# Altium schematic sheet OBC_SRAM.SchDoc: SRAM
size A4; SheetNumber: 8; SheetTotal: 10
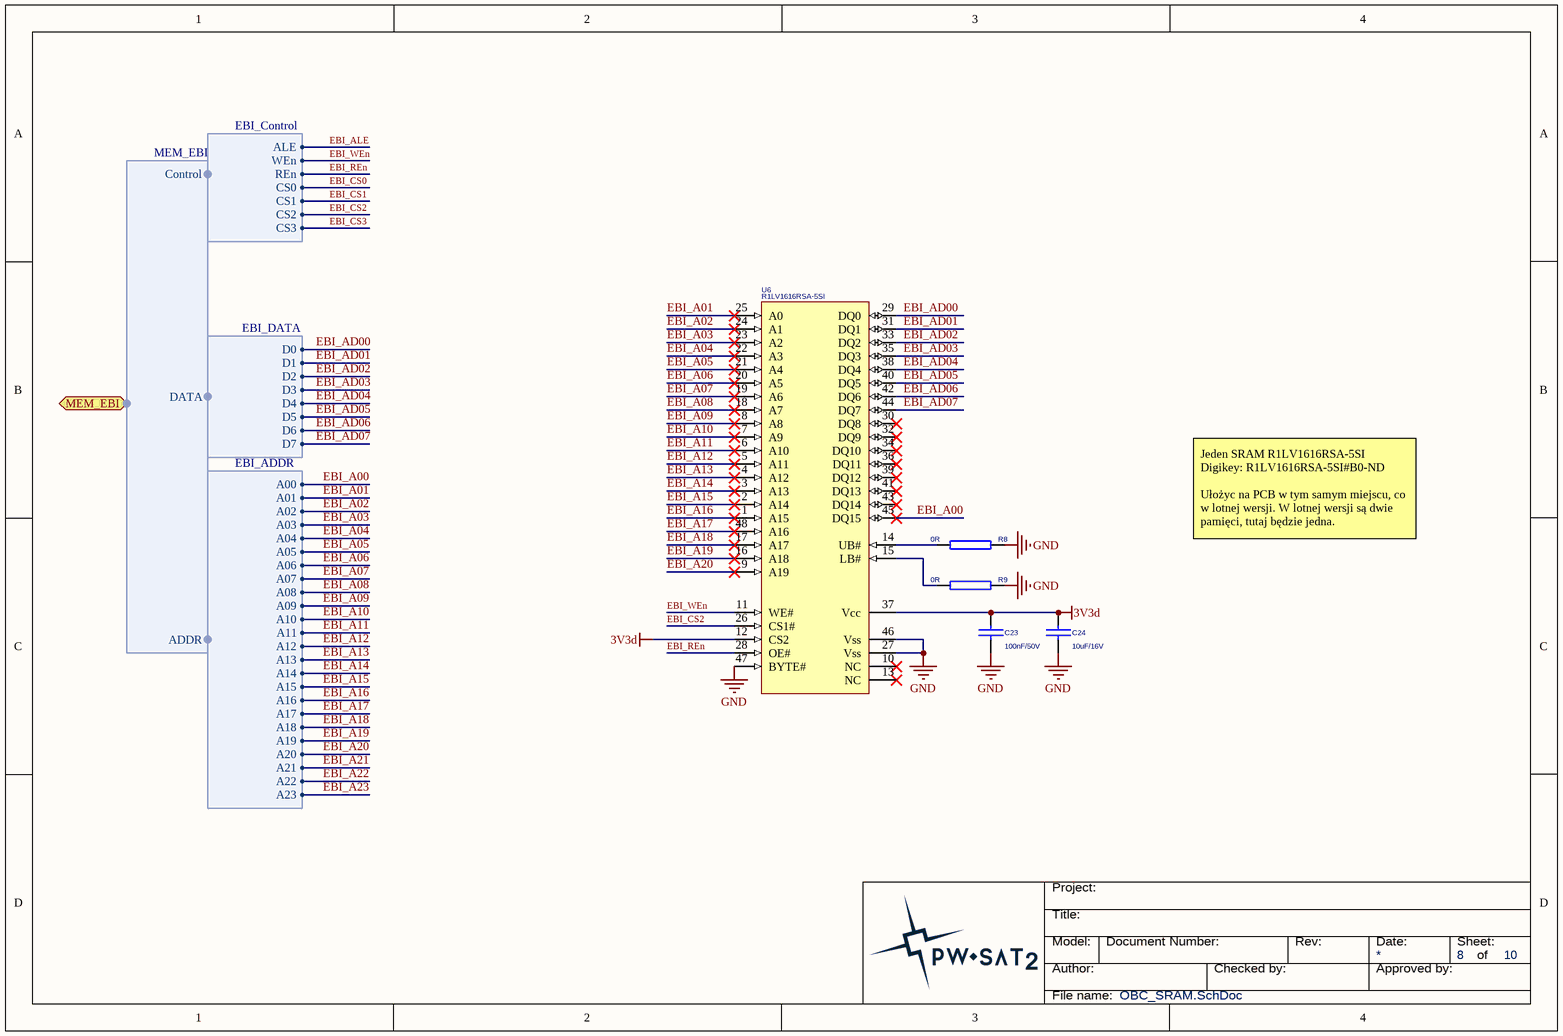
[diagram p0: OBC_SRAM.SchDoc]

## Parts
C23  100nF/50V  [C0603]
C24  10uF/16V  [C1206]
R8  0R  [R0603]
R9  0R  [R0603]
U6  R1LV1616RSA-5SI  [TSSOP50P2000X125-48N]

## Ports
MEM_EBI (harness MEM_EBI)

## Harnesses
MEM_EBI: DATA, ADDR, Control
EBI_Control: ALE, WEn, REn, CS0, CS1, CS2, CS3
EBI_ADDR: A09, A10, A11, A12, A13, A14, A15, A08, A16, A17, A18, A19, A20, A21, A22, A23, A00, A01, A02, A03, A04, A05, A06, A07
EBI_DATA: D6, D5, D4, D3, D2, D1, D0, D7

## Nets
3V3d: C23.1 C24.1 U6.12(CS2) U6.37(Vcc)
GND: C23.2 C24.2 R8.2 R9.2 U6.27(Vss) U6.46(Vss) U6.47(BYTE#)
EBI_A00: U6.45(DQ15) ; harness EBI_ADDR.A00
EBI_A01: U6.25(A0) ; harness EBI_ADDR.A01
EBI_A02: U6.24(A1) ; harness EBI_ADDR.A02
EBI_A03: U6.23(A2) ; harness EBI_ADDR.A03
EBI_A04: U6.22(A3) ; harness EBI_ADDR.A04
EBI_A05: U6.21(A4) ; harness EBI_ADDR.A05
EBI_A06: U6.20(A5) ; harness EBI_ADDR.A06
EBI_A07: U6.19(A6) ; harness EBI_ADDR.A07
EBI_A08: U6.18(A7) ; harness EBI_ADDR.A08
EBI_A09: U6.8(A8) ; harness EBI_ADDR.A09
EBI_A10: U6.7(A9) ; harness EBI_ADDR.A10
EBI_A11: U6.6(A10) ; harness EBI_ADDR.A11
EBI_A12: U6.5(A11) ; harness EBI_ADDR.A12
EBI_A13: U6.4(A12) ; harness EBI_ADDR.A13
EBI_A14: U6.3(A13) ; harness EBI_ADDR.A14
EBI_A15: U6.2(A14) ; harness EBI_ADDR.A15
EBI_A16: U6.1(A15) ; harness EBI_ADDR.A16
EBI_A17: U6.48(A16) ; harness EBI_ADDR.A17
EBI_A18: U6.17(A17) ; harness EBI_ADDR.A18
EBI_A19: U6.16(A18) ; harness EBI_ADDR.A19
EBI_A20: U6.9(A19) ; harness EBI_ADDR.A20
EBI_A21: harness EBI_ADDR.A21
EBI_A22: harness EBI_ADDR.A22
EBI_A23: harness EBI_ADDR.A23
EBI_AD00: U6.29(DQ0) ; harness EBI_DATA.D0
EBI_AD01: U6.31(DQ1) ; harness EBI_DATA.D1
EBI_AD02: U6.33(DQ2) ; harness EBI_DATA.D2
EBI_AD03: U6.35(DQ3) ; harness EBI_DATA.D3
EBI_AD04: U6.38(DQ4) ; harness EBI_DATA.D4
EBI_AD05: U6.40(DQ5) ; harness EBI_DATA.D5
EBI_AD06: U6.42(DQ6) ; harness EBI_DATA.D6
EBI_AD07: U6.44(DQ7) ; harness EBI_DATA.D7
EBI_ALE: harness EBI_Control.ALE
EBI_CS0: harness EBI_Control.CS0
EBI_CS1: harness EBI_Control.CS1
EBI_CS2: U6.26(CS1#) ; harness EBI_Control.CS2
EBI_CS3: harness EBI_Control.CS3
EBI_REn: U6.28(OE#) ; harness EBI_Control.REn
EBI_WEn: U6.11(WE#) ; harness EBI_Control.WEn
NetR8_1: R8.1 U6.14(UB#)
NetR9_1: R9.1 U6.15(LB#)

Not connected (* = marked no-connect by the designer): U6 10(NC)* 13(NC)* 30(DQ8)* 32(DQ9)* 34(DQ10)* 36(DQ11)* 39(DQ12)* 41(DQ13)* 43(DQ14)*

## Notes on the sheet
- Jeden SRAM R1LV1616RSA-5SI
  Digikey: R1LV1616RSA-5SI#B0-ND
  Ułożyc na PCB w tym samym miejscu, co w lotnej wersji. W lotnej wersji są dwie pamięci, tutaj będzie jedna.
- Title:
- Project:
- Author:
- Model:
- Document Number:
- Checked by:
- Rev:
- Date:
- Approved by:
- Sheet:
- of
- File name:

## Library data of the parts
C23 = CAP: Capacitator; Voltage: 50V; Material: X7R; Value: 100nF; Farnell: 1759122; Supplier Part Number 1: 1759122; Supplier 1: Farnell
C24 = CAP: Capacitator; Voltage: 16V; Material: X5R; Value: 10uF; Farnell: 2320922; Supplier Part Number 1: 2320922; Supplier 1: Farnell
R8 R9 = RES: Resistor; Farnell: 2447060; Value: 0R; Supplier Part Number 1: 2447060; Supplier 1: Farnell
U6 = R1LV1616RSA-5SI: IC SRAM 16MBIT 55NS 48TSOP; Manufacturer: Renesas Electronics; partNo: R1LV1616RSA-5SI; DigiKey: R1LV1616RSA-5SI#B0-ND; Supplier 1: Digi-Key